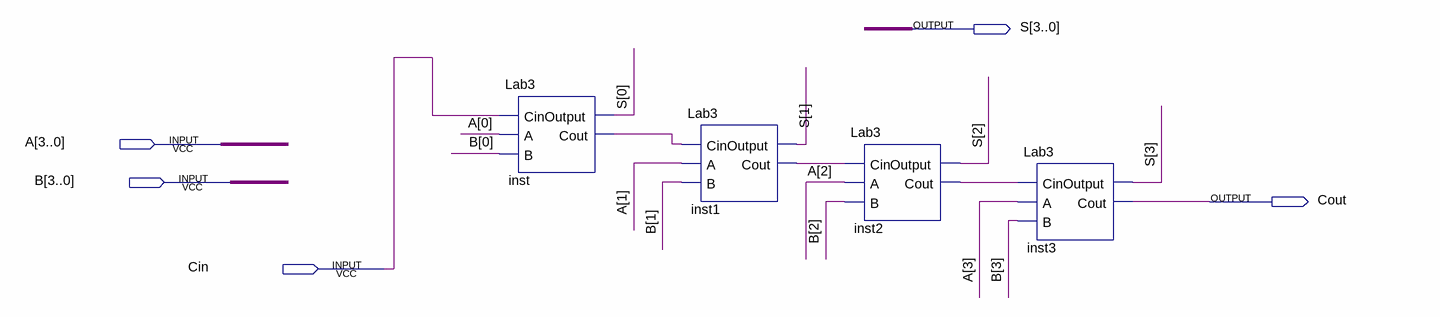
[diagram p0: schematic sheet]
// Quartus schematic FA4bit.bdf as structural Verilog: 4 symbols, 5 pins
module FA4bit (
  input  [3:0] A,
  input  [3:0] B,
  input  Cin,
  output [3:0] S,
  output Cout
);

  wire inst1_cout, inst2_cout, inst_cout;

  Lab3 inst (.Cin(Cin), .A(A[0]), .B(B[0]), .Output(S[0]), .Cout(inst_cout));
  Lab3 inst1 (.Cin(inst_cout), .A(A[1]), .B(B[1]), .Output(S[1]), .Cout(inst1_cout));
  Lab3 inst2 (.Cin(inst1_cout), .A(A[2]), .B(B[2]), .Output(S[2]), .Cout(inst2_cout));
  Lab3 inst3 (.Cin(inst2_cout), .A(A[3]), .B(B[3]), .Output(S[3]), .Cout(Cout));
endmodule
